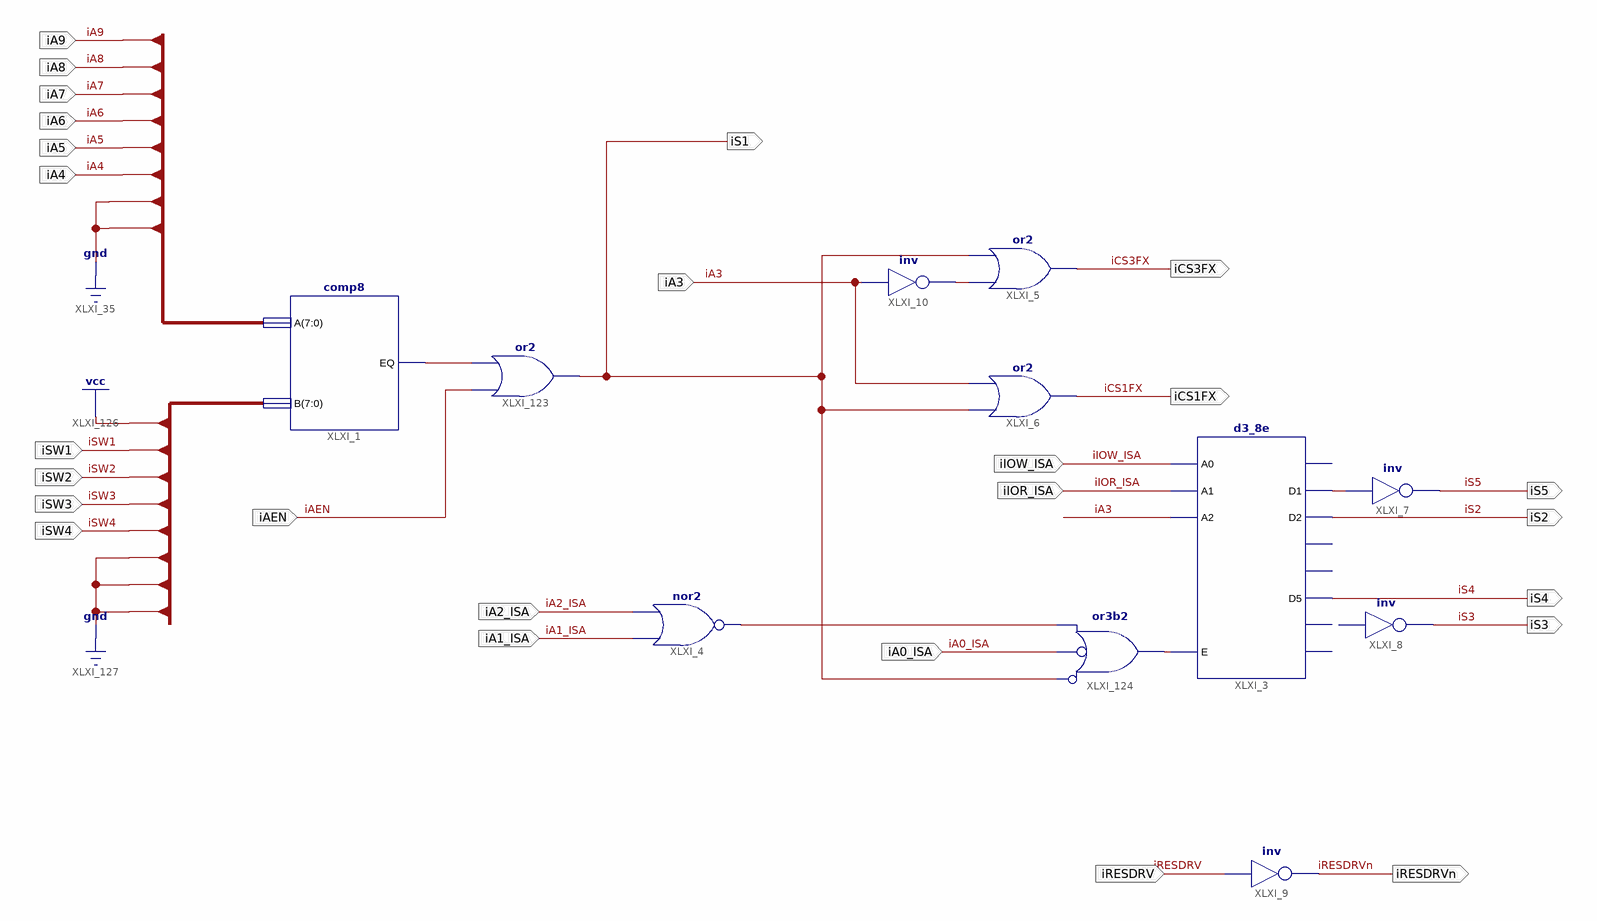
[diagram p0: schematic sheet 1]
// Xilinx ISE schematic IDE_DECODE.sch (xc9500) as structural Verilog: 11 symbols, 26 ports
module IDE_DECODE (
  input  iAEN,
  input  iA2_ISA,
  input  iA1_ISA,
  input  iA3,
  input  iIOW_ISA,
  input  iIOR_ISA,
  input  iA0_ISA,
  input  iRESDRV,
  input  iA9,
  input  iA8,
  input  iA7,
  input  iA6,
  input  iA5,
  input  iA4,
  input  iSW1,
  input  iSW2,
  input  iSW3,
  input  iSW4,
  output iS1,
  output iS5,
  output iS2,
  output iS4,
  output iS3,
  output iCS3FX,
  output iCS1FX,
  output iRESDRVn
);

  wire XLXN_1, XLXN_2, XLXN_111, XLXN_112, XLXN_113;
  wire [7:0] XLXN_36, XLXN_135;

  comp8 XLXI_1 (.A(XLXN_36), .B(XLXN_135), .EQ(XLXN_113));
  d3_8e XLXI_3 (
    .A0(iIOW_ISA), .A1(iIOR_ISA), .A2(iA3), .E(XLXN_111), .D1(XLXN_1), .D2(iS2), .D5(iS4));  // open: D0, D3, D4, D6, D7
  or XLXI_5 (iCS3FX, XLXN_2, iS1);
  or XLXI_6 (iCS1FX, iS1, iA3);
  not XLXI_7 (iS5, XLXN_1);
  // inv XLXI_8 has open pins: I=open, O=iS3
  not XLXI_10 (XLXN_2, iA3);
  or XLXI_123 (iS1, iAEN, XLXN_113);
  or XLXI_124 (XLXN_111, ~iS1, ~iA0_ISA, XLXN_112);  // or3b2
  nor XLXI_4 (XLXN_112, iA1_ISA, iA2_ISA);
  not XLXI_9 (iRESDRVn, iRESDRV);
endmodule
